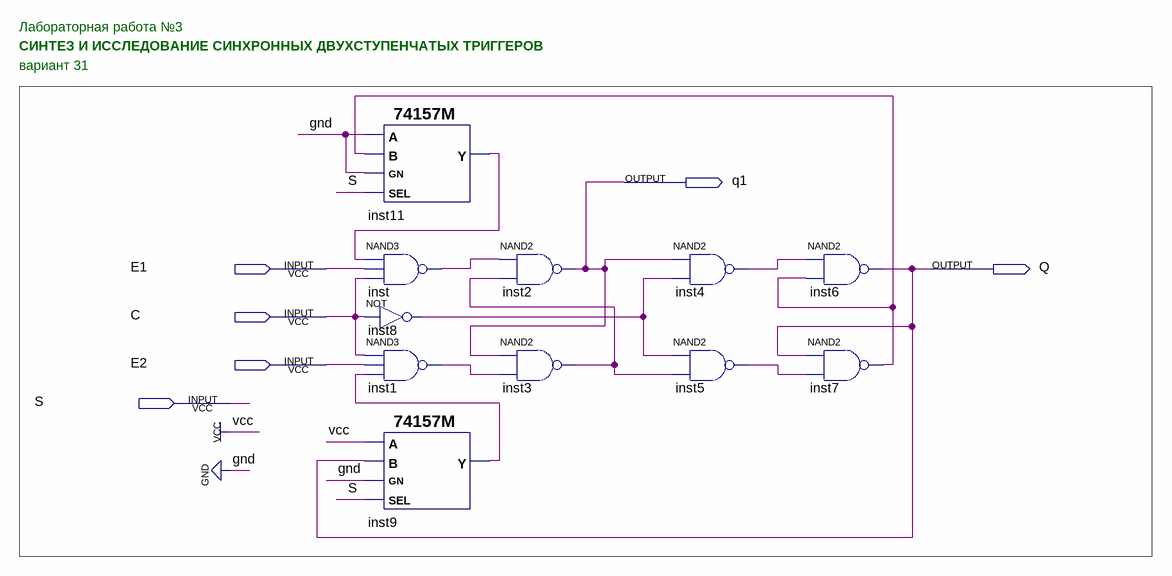
[diagram p0: schematic sheet]
// Quartus schematic Shema.bdf as structural Verilog: 11 symbols, 6 pins
module Shema (
  input  E1,
  input  C,
  input  E2,
  input  S,
  output q1,
  output Q
);

  wire inst1_out, inst3_out, inst4_out, inst5_out, inst7_out, inst8_out, inst9_y, inst11_y, inst_out;

  \74157M  inst11 (.SEL(S), .GN(1'b0), .B(inst7_out), .A(1'b0), .Y(inst11_y));
  nand inst (inst_out, inst11_y, E1, C);
  not inst8 (inst8_out, C);
  nand inst1 (inst1_out, C, E2, inst9_y);
  \74157M  inst9 (.SEL(S), .GN(1'b0), .B(Q), .A(1'b1), .Y(inst9_y));
  nand inst2 (q1, inst_out, inst3_out);
  nand inst3 (inst3_out, q1, inst1_out);
  nand inst4 (inst4_out, q1, inst8_out);
  nand inst5 (inst5_out, inst8_out, inst3_out);
  nand inst6 (Q, inst4_out, inst7_out);
  nand inst7 (inst7_out, Q, inst5_out);

  // Notes on the sheet:
  //   Лабораторная работа №3
  //   СИНТЕЗ И ИССЛЕДОВАНИЕ СИНХРОННЫХ ДВУХСТУПЕНЧАТЫХ ТРИГГЕРОВ
  //   вариант 31
endmodule
